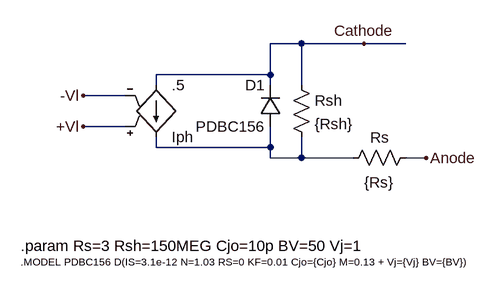
[diagram p0: schematic photodiode.asc]
photodiode.asc, the LTspice schematic file:
Version 4
SHEET 1 2040 680
WIRE 496 64 448 64
WIRE 592 64 496 64
WIRE 656 64 592 64
WIRE 448 112 448 64
WIRE 448 112 272 112
WIRE 272 128 272 112
WIRE 448 128 448 112
WIRE 496 128 496 64
WIRE 224 144 160 144
WIRE 224 192 160 192
WIRE 272 224 272 208
WIRE 448 224 448 192
WIRE 448 224 272 224
WIRE 448 240 448 224
WIRE 496 240 496 208
WIRE 496 240 448 240
WIRE 576 240 496 240
WIRE 688 240 656 240
FLAG 592 64 Cathode
FLAG 688 240 Anode
FLAG 160 144 -Vl
FLAG 160 192 +Vl
SYMBOL diode 464 192 R180
WINDOW 0 24 64 Left 2
WINDOW 3 24 0 Left 2
SYMATTR InstName D1
SYMATTR Value PDBC156
SYMBOL res 480 112 R0
SYMATTR InstName Rsh
SYMATTR Value {Rsh}
SYMBOL res 560 256 R270
WINDOW 0 32 56 VTop 2
WINDOW 3 -6 55 VBottom 2
SYMATTR InstName Rs
SYMATTR Value {Rs}
SYMBOL g 272 224 M180
SYMATTR InstName Iph
SYMATTR Value .5
TEXT 64 400 Left 1 !.MODEL PDBC156 D(IS=3.1e-12 N=1.03 RS=0 KF=0.01 Cjo={Cjo} M=0.13 + Vj={Vj} BV={BV})
TEXT 64 376 Left 2 !.param Rs=3 Rsh=150MEG Cjo=10p BV=50 Vj=1

The netlist it stands for:
* photodiode.asc
D1 N001 Cathode PDBC156
Rsh Cathode N001 {Rsh}
Rs N001 Anode {Rs}
G§Iph Cathode N001 +Vl -Vl .5
.model D D
.lib standard.dio
.MODEL PDBC156 D(IS=3.1e-12 N=1.03 RS=0 KF=0.01 Cjo={Cjo} M=0.13 + Vj={Vj} BV={BV})
.param Rs=3 Rsh=150MEG Cjo=10p BV=50 Vj=1
.backanno
.end